# Altium schematic sheet BSheetSchematicTemplateWWU.SchDoc: [SheetTitle]
size B; Date: [Date]; SheetNumber: 1; SheetTotal: 1
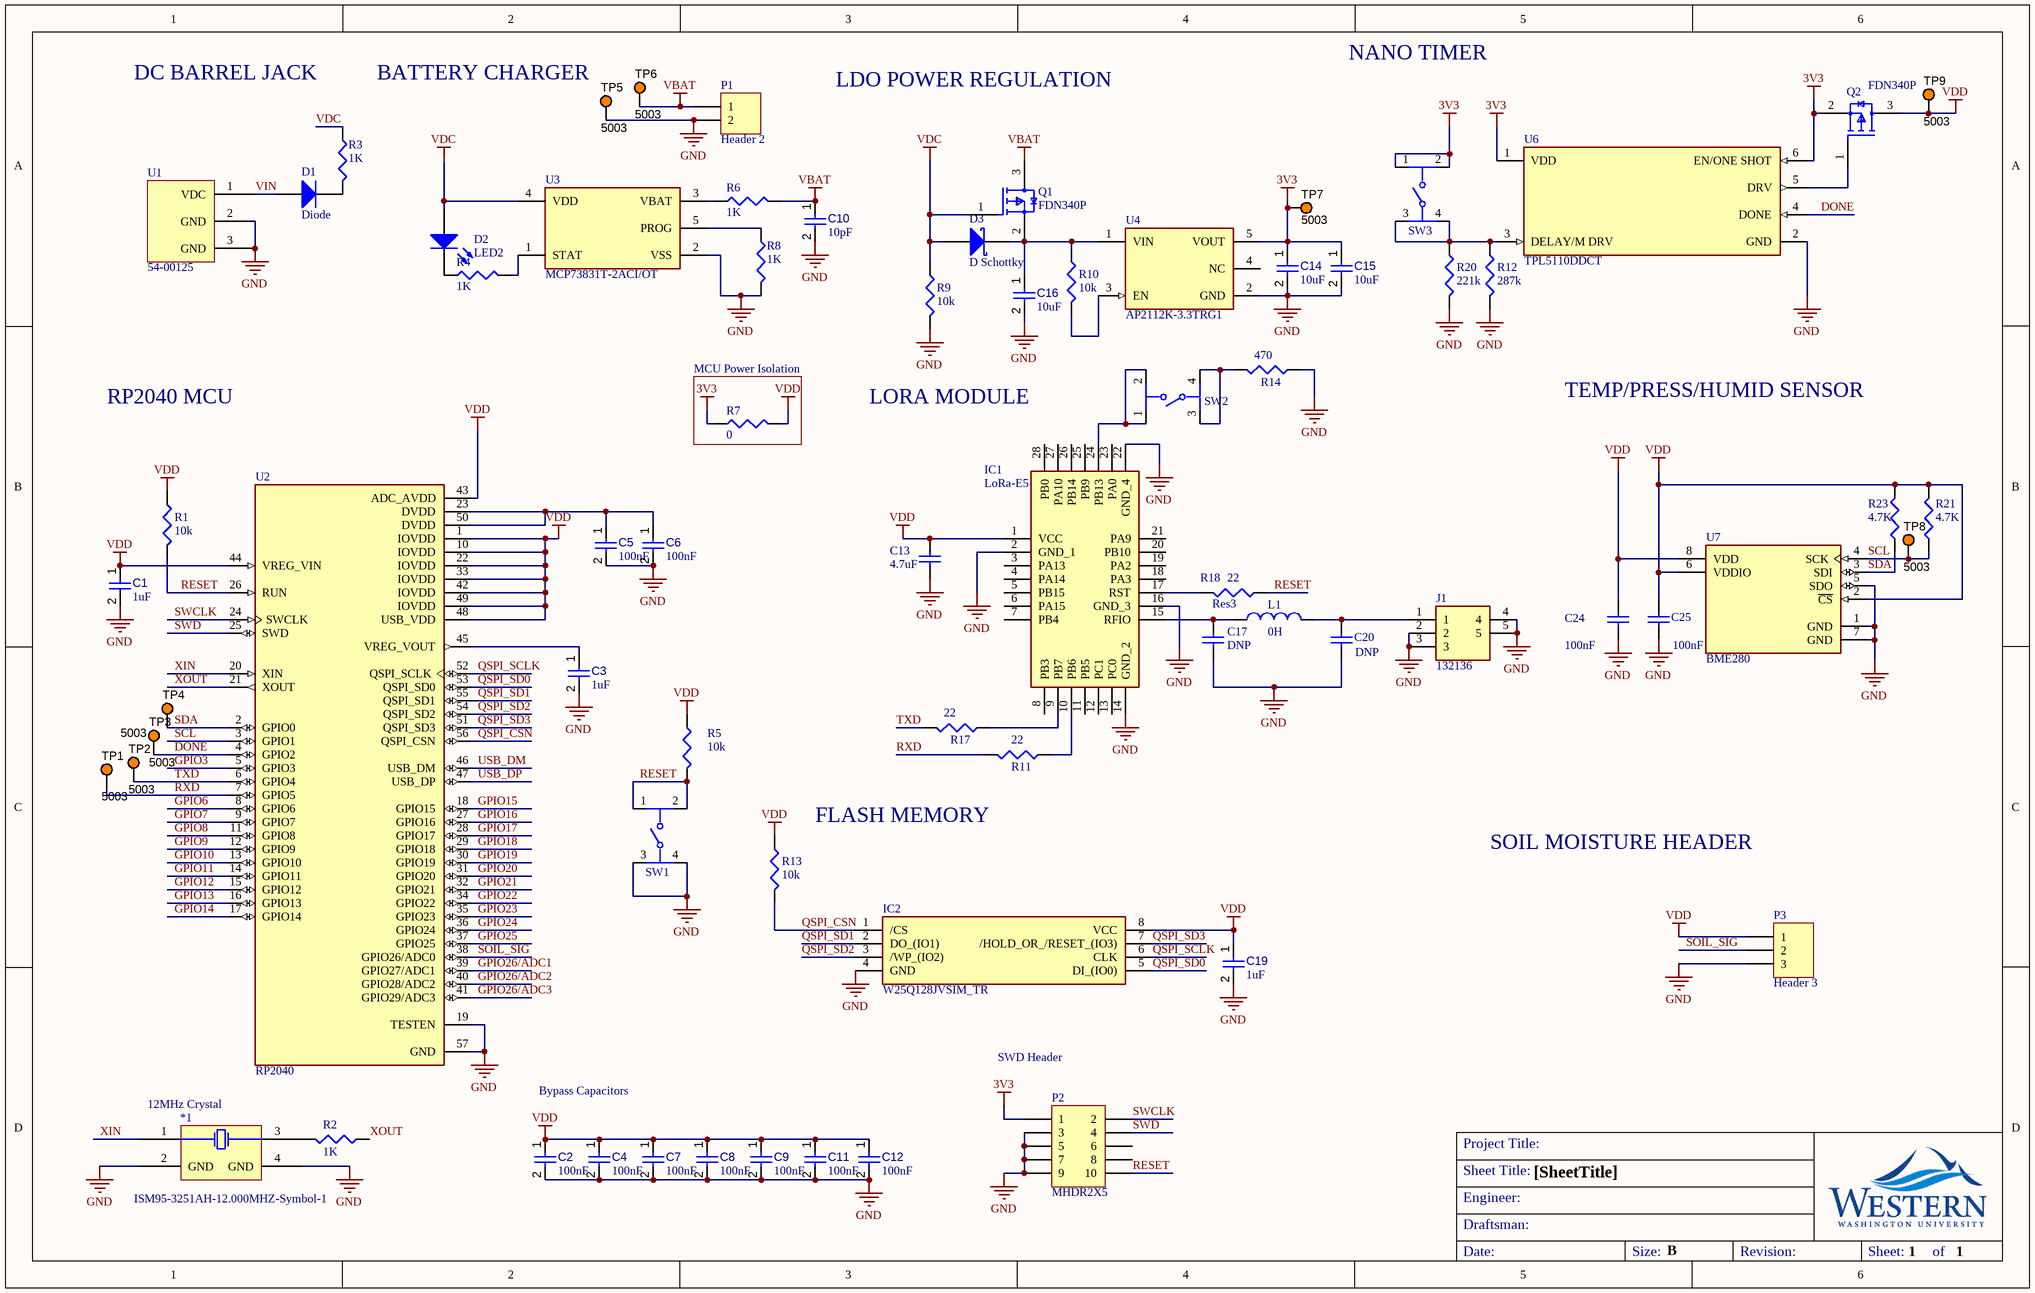
[diagram p0: BSheetSchematicTemplateWWU.SchDoc]

## Parts
*1  ISM95-3251AH-12.000MHZ-Symbol-1  [OSC_ISM951251AH32000MHZ]
C1  value 1uF  [CAPC1608X87X35NL15T15]  (hidden comment: Capacitor 10 pF +/- 0.25 pF 50 V 0603)
C2  value 100nF  [CAPC1608X87X35NL15T15]  (hidden comment: Capacitor 10 pF +/- 0.25 pF 50 V 0603)
C3  value 1uF  [CAPC1608X87X35NL15T15]  (hidden comment: Capacitor 10 pF +/- 0.25 pF 50 V 0603)
C4  value 100nF  [CAPC1608X87X35NL15T15]  (hidden comment: Capacitor 10 pF +/- 0.25 pF 50 V 0603)
C5  value 100nF  [CAPC1608X87X35NL15T15]  (hidden comment: Capacitor 10 pF +/- 0.25 pF 50 V 0603)
C6  value 100nF  [CAPC1608X87X35NL15T15]  (hidden comment: Capacitor 10 pF +/- 0.25 pF 50 V 0603)
C7  value 100nF  [CAPC1608X87X35NL15T15]  (hidden comment: Capacitor 10 pF +/- 0.25 pF 50 V 0603)
C8  value 100nF  [CAPC1608X87X35NL15T15]  (hidden comment: Capacitor 10 pF +/- 0.25 pF 50 V 0603)
C9  value 100nF  [CAPC1608X87X35NL15T15]  (hidden comment: Capacitor 10 pF +/- 0.25 pF 50 V 0603)
C10  value 10pF  [CAPC1608X87X35NL15T15]  (hidden comment: Capacitor 10 pF +/- 0.25 pF 50 V 0603)
C11  value 100nF  [CAPC1608X87X35NL15T15]  (hidden comment: Capacitor 10 pF +/- 0.25 pF 50 V 0603)
C12  value 100nF  [CAPC1608X87X35NL15T15]  (hidden comment: Capacitor 10 pF +/- 0.25 pF 50 V 0603)
C13  value 4.7uF  [1608[0603]]  (hidden comment: Cap Semi)
C14  value 10uF  [CAPC1608X87X35NL15T15]  (hidden comment: Capacitor 10 pF +/- 0.25 pF 50 V 0603)
C15  value 10uF  [CAPC1608X87X35NL15T15]  (hidden comment: Capacitor 10 pF +/- 0.25 pF 50 V 0603)
C16  value 10uF  [CAPC1608X87X35NL15T15]  (hidden comment: Capacitor 10 pF +/- 0.25 pF 50 V 0603)
C17  value DNP  [1608[0603]]  (hidden comment: Cap Semi)
C19  value 1uF  [CAPC1608X87X35NL15T15]  (hidden comment: Capacitor 10 pF +/- 0.25 pF 50 V 0603)
C20  value DNP  [1608[0603]]  (hidden comment: Cap Semi)
C24  value 100nF  [1608[0603]]  (hidden comment: Cap Semi)
C25  value 100nF  [1608[0603]]  (hidden comment: Cap Semi)
D1  Diode  [SMC]
D2  LED2  [3.2X1.6X1.1]
D3  D Schottky  [SMB]
IC1  LoRa-E5  [LoRaE5]
IC2  W25Q128JVSIM_TR  [SOIC127P790X216-8N]
J1  132136  [132136]
L1  value 0H  [0603]  (hidden comment: Inductor)
P1  Header 2  [HDR1X2]
P2  MHDR2X5  [MHDR2X5]
P3  Header 3  [HDR1X3]
Q1  FDN340P  [FP-527AG-MFG]
Q2  FDN340P  [FP-527AG-MFG]
R1  value 10k  [J1-0603]  (hidden comment: Res3)
R2  value 1K  [J1-0603]  (hidden comment: Res3)
R3  value 1K  [J1-0603]  (hidden comment: Res3)
R4  value 1K  [J1-0603]  (hidden comment: Res3)
R5  value 10k  [J1-0603]  (hidden comment: Res3)
R6  value 1K  [J1-0603]  (hidden comment: Res3)
R7  value 0  [J1-0603]  (hidden comment: Res3)
R8  value 1K  [J1-0603]  (hidden comment: Res3)
R9  value 10k  [J1-0603]  (hidden comment: Res3)
R10  value 10k  [J1-0603]  (hidden comment: Res3)
R11  value 22  [J1-0603]  (hidden comment: Res3)
R12  value 287k  [J1-0603]  (hidden comment: Res3)
R13  value 10k  [J1-0603]  (hidden comment: Res3)
R14  value 470  [J1-0603]  (hidden comment: Res3)
R17  value 22  [J1-0603]  (hidden comment: Res3)
R18  Res3  value 22  [J1-0603]
R20  value 221k  [J1-0603]  (hidden comment: Res3)
R21  value 4.7K  [J1-0603]  (hidden comment: Res3)
R23  value 4.7K  [J1-0603]  (hidden comment: Res3)
SW1  PTS645SM43SMTR92LFS  [FP-PTS645SM43SMTR92LFS-MFG]  (value not drawn)
SW2  PTS645SM43SMTR92LFS  [FP-PTS645SM43SMTR92LFS-MFG]  (value not drawn)
SW3  PTS645SM43SMTR92LFS  [FP-PTS645SM43SMTR92LFS-MFG]  (value not drawn)
TP1  5003  [KSTN-5003]
TP2  5003  [KSTN-5003]
TP3  5003  [KSTN-5003]
TP4  5003  [KSTN-5003]
TP5  5003  [KSTN-5003]
TP6  5003  [KSTN-5003]
TP7  5003  [KSTN-5003]
TP8  5003  [KSTN-5003]
TP9  5003  [KSTN-5003]
U1  54-00125  [54-00125]
U2  RP2040  [QFN40P700X700X90-57N-D]
U3  MCP73831T-2ACI/OT  [FP-C04-091-OT-IPC_B]
U4  AP2112K-3.3TRG1  [FP-SOT25-IPC_A]
U6  TPL5110DDCT  [FP-DDC0006A-MFG]
U7  BME280  [FP-BME280-MFG]

## Blocks framed on the sheet
MCU Power Isolation: R7

## Nets
3V3: C14.1 C15.1 P2.1 Q2.2(S) R7.1 SW3.1 SW3.2 TP7.1 U4.5(VOUT) U6.1(VDD) U6.6(EN/ONE_SHOT)
GND: *1.2(GND) *1.4(GND) C1.2 C2.2 C3.2 C4.2 C5.2 C6.2 C7.2 C8.2 C9.2 C10.2 C11.2 C12.2 C13.1 C14.2 C15.2 C16.2 C17.1 C19.2 C20.1 C24.1 C25.1 IC1.2(GND_1) IC1.14(GND_2) IC1.16(GND_3) IC1.22(GND_4) IC2.4(GND) J1.2 J1.3 J1.4 J1.5 P1.2 P2.3 P2.5 P2.7 P2.9 P3.3 R8.2 R9.2 R12.2 R14.1 R20.2 SW1.3 SW1.4 TP5.1 U1.2(GND) U1.3(GND) U2.19(TESTEN) U2.57(GND) U3.2(VSS) U4.2(GND) U6.2(GND) U7.1(GND) U7.5(SDO) U7.7(GND)
VBAT: C10.1 P1.1 Q1.3(D) R6.2 TP6.1
VDC: D2.1(A) D3.1(A) Q1.1(G) R3.1 R9.1 U3.4(VDD)
VDD: C1.1 C2.1 C4.1 C7.1 C8.1 C9.1 C11.1 C12.1 C13.2 C19.1 C24.2 C25.2 IC1.1(VCC) IC2.8(VCC) P3.1 Q2.3(D) R1.1 R5.1 R7.2 R13.1 R21.2 R23.2 TP9.1 U2.1(IOVDD) U2.10(IOVDD) U2.22(IOVDD) U2.33(IOVDD) U2.42(IOVDD) U2.43(ADC_AVDD) U2.44(VREG_VIN) U2.48(USB_VDD) U2.49(IOVDD) U7.2(~{CS}) U7.6(VDDIO) U7.8(VDD)
DONE: TP3.1 U2.4(GPIO2) U6.4(DONE)
GPIO3: U2.5(GPIO3)
GPIO6: U2.8(GPIO6)
GPIO7: U2.9(GPIO7)
GPIO8: U2.11(GPIO8)
GPIO9: U2.12(GPIO9)
GPIO10: U2.13(GPIO10)
GPIO11: U2.14(GPIO11)
GPIO12: U2.15(GPIO12)
GPIO13: U2.16(GPIO13)
GPIO14: U2.17(GPIO14)
GPIO15: U2.18(GPIO15)
GPIO16: U2.27(GPIO16)
GPIO17: U2.28(GPIO17)
GPIO18: U2.29(GPIO18)
GPIO19: U2.30(GPIO19)
GPIO20: U2.31(GPIO20)
GPIO21: U2.32(GPIO21)
GPIO22: U2.34(GPIO22)
GPIO23: U2.35(GPIO23)
GPIO24: U2.36(GPIO24)
GPIO25: U2.37(GPIO25)
GPIO26/ADC1: U2.39(GPIO27/ADC1)
GPIO26/ADC2: U2.40(GPIO28/ADC2)
GPIO26/ADC3: U2.41(GPIO29/ADC3)
QSPI_CSN: IC2.1(/CS) R13.2 U2.56(QSPI_CSN)
QSPI_SCLK: IC2.6(CLK) U2.52(QSPI_SCLK)
QSPI_SD0: IC2.5(DI_(IO0)) U2.53(QSPI_SD0)
QSPI_SD1: IC2.2(DO_(IO1)) U2.55(QSPI_SD1)
QSPI_SD2: IC2.3(/WP_(IO2)) U2.54(QSPI_SD2)
QSPI_SD3: IC2.7(/HOLD_OR_/RESET_(IO3)) U2.51(QSPI_SD3)
RESET: P2.10 R1.2 R5.2 R18.1 SW1.1 SW1.2 U2.26(RUN)
RXD: R11.2 TP1.1 U2.7(GPIO5)
SCL: R21.1 TP8.1 U2.3(GPIO1) U7.4(SCK)
SDA: R23.1 TP4.1 U2.2(GPIO0) U7.3(SDI)
SOIL_SIG: P3.2 U2.38(GPIO26/ADC0)
SWCLK: P2.2 U2.24(SWCLK)
SWD: P2.4 U2.25(SWD)
TXD: R17.2 TP2.1 U2.6(GPIO4)
USB_DM: U2.46(USB_DM)
USB_DP: U2.47(USB_DP)
VIN: D1.1(A) U1.1(VDC)
XIN: *1.1(X1) U2.20(XIN)
XOUT: R2.1 U2.21(XOUT)
Net*1_3: *1.3(X2) R2.2
NetC3_1: C3.1 U2.45(VREG_VOUT)
NetC5_1: C5.1 C6.1 U2.23(DVDD) U2.50(DVDD)
NetC16_1: C16.1 D3.2(K) Q1.2(S) R10.1 U4.1(VIN)
NetC17_2: C17.2 IC1.15(RFIO) L1.1
NetC20_2: C20.2 J1.1 L1.2
NetD1_2: D1.2(K) R3.2
NetD2_2: D2.2(K) R4.1
NetIC1_9: IC1.9(PB7) R17.1
NetIC1_10: IC1.10(PB6) R11.1
NetIC1_17: IC1.17(RST) R18.2
NetIC1_24: IC1.24(PB13) SW2.1 SW2.2
NetQ2_1: Q2.1(G) U6.5(DRV)
NetR4_2: R4.2 U3.1(STAT)
NetR6_1: R6.1 U3.3(VBAT)
NetR8_1: R8.1 U3.5(PROG)
NetR10_2: R10.2 U4.3(EN)
NetR12_1: R12.1 R20.1 SW3.3 SW3.4 U6.3(DELAY/M_DRV)
NetR14_2: R14.2 SW2.3 SW2.4

Not connected (* = marked no-connect by the designer): IC1 3(PA13) 4(PA14) 5(PB15) 6(PA15) 7(PB4) 8(PB3) 11(PB5) 12(PC1) 13(PC0) 18(PA3) 19(PA2) 20(PB10) 21(PA9) 23(PA0) 25(PB9) 26(PB14) 27(PA10) 28(PB0); P2 6 8; U4 4(NC)

## Notes on the sheet
- DC BARREL JACK
- BATTERY CHARGER
- LDO POWER REGULATION
- NANO TIMER
- RP2040 MCU
- LORA MODULE
- TEMP/PRESS/HUMID SENSOR
- FLASH MEMORY
- SOIL MOISTURE HEADER
- (near *1) 12MHz Crystal
- Bypass Capacitors
- SWD Header
- Sheet Title:
- Project Title:
- Engineer:
- Draftsman:
- Date:
- Size:
- B
- Revision:
- Sheet:        of

## Library data of the parts
C1-C12 C14-C16 C19 = CMP-001-00012-5: Chip Capacitor, 10 pF, +/- 0.25 pF, 50 V, 0603 (1608 Metric); Capacitor Type: Ceramic; Voltage Rating: 50V; Tolerance: 0.25%; Min Operating Temperature: -55°C; Case/Package: 0603; Pins: 2; RoHS Compliant: True; Max Operating Temperature: 125°C; Mounting Technology: SM
C13 C17 C20 C24 C25 = Cap Semi: Capacitor (Semiconductor SIM Model); Published: 8-Jun-2000; LatestRevisionDate: 29-May-2009; LatestRevisionNote: IPC-7351 Footprint Added.; PackageReference: C1206; Publisher: Altium Limited; PackageDescription: Chip Capacitor
D1 = Diode: Default Diode; Published: 8-Jun-2000; LatestRevisionDate: 17-Jul-2002; LatestRevisionNote: Re-released for DXP Platform.; PackageVersion: Sep-1996; PackageReference: SMC; Publisher: Altium Limited; PackageDescription: DO-214-AB/SMC; 2 C-Bend Leads; Body 7.9 x 5.9 mm, inc. leads (LxW); Code_JEDEC: DO-214-AB
D2 = LED2: Typical RED, GREEN, YELLOW, AMBER GaAs LED; Published: 8-Jun-2000; LatestRevisionDate: 17-Jul-2002; LatestRevisionNote: Re-released for DXP Platform.; PackageVersion: Feb-2002; PackageReference: 3.2X1.6X1.1; Publisher: Altium Limited; PackageDescription: SM LED; 2 Flat Leads
D3 = D Schottky: Schottky Diode; Published: 8-Jun-2000; LatestRevisionDate: 17-Jul-2002; LatestRevisionNote: Re-released for DXP Platform.; PackageReference: SMB; Publisher: Altium Limited; PackageDescription: DO-214-AA/SMB; 2 C-Bend Leads; Body 5.3 x 3.6 mm, inc. leads (LxW); Code_JEDEC: DO-214-AA
IC1 = LoRa-E5: Integrated Circuit; Manufacturer_Name: Seeed Studio; Datasheet Link: https://no.mouser.com/datasheet/2/744/LoRa_E5_module_datasheet_V1_0-2488126.pdf; Height: 2.5mm; Manufacturer_Part_Number: LoRa-E5
IC2 = W25Q128JVSIM_TR: Integrated Circuit; Manufacturer_Name: Winbond; Manufacturer_Part_Number: W25Q128JVSIM TR; Datasheet Link: http://www.winbond.com/resource-files/w25q128jv%20dtr%20revb%2011042016.pdf; Height: 2.16mm; Mouser Part Number: 454-W25Q128JVSIMTR; Mouser Price/Stock: https://www.mouser.co.uk/ProductDetail/Winbond/W25Q128JVSIM-TR?qs=qSfuJ%252Bfl%2Fd6ji9IuruL6Zg%3D%3D; Arrow Part Number: W25Q128JVSIM TR; Arrow Price/Stock: https://www.arrow.com/en/products/w25q128jvsimtr/winbond-electronics?region=nac
J1 = 132136: Connector; Manufacturer_Name: Amphenol; Datasheet Link: https://componentsearchengine.com/Datasheets/5/132136.pdf; Height: 10.26mm; Manufacturer_Part_Number: 132136; Mouser Part Number: 523-132136; Mouser Price/Stock: https://www.mouser.co.uk/ProductDetail/Amphenol-RF/132136?qs=Ld4zsxSTIA6C8fkM7Uvm2Q%3D%3D; Arrow Part Number: 132136; Arrow Price/Stock: https://www.arrow.com/en/products/132136/amphenol-rf
L1 = Inductor: Code_IEC: 1005; Published: 8-Jun-2000; LatestRevisionDate: 29-May-2009; LatestRevisionNote: IPC-7351 Footprint Added.; PackageReference: 0402-A; Publisher: Altium Limited; PackageDescription: Chip Inductor; Code_JEITA: 0402
P1 = Header 2: Header, 2-Pin; LatestRevisionDate: 17-Jul-2002; LatestRevisionNote: Re-released for DXP Platform.; Publisher: Altium Limited
P2 = MHDR2X5: Header, 5-Pin, Dual row; LatestRevisionDate: 17-Jul-2002; LatestRevisionNote: Re-released for DXP Platform.; Publisher: Altium Limited
P3 = Header 3: Header, 3-Pin; LatestRevisionDate: 17-Jul-2002; LatestRevisionNote: Re-released for DXP Platform.; Publisher: Altium Limited
Q1 Q2 = CMP-2100-03638-2: MOSFET P-CH 20V 2A SSOT3; Fall Time: 11ns; Rise Time: 9ns; Voltage Rating (DC): -20V; Power Dissipation: 500mW; Nominal Vgs: -800mV; Current Rating: -2A; Gate to Source Voltage (Vgs): 8V; Rds On Max: 70mR; Turn-Off Delay Time: 27ns; Element Configuration: Single; Number of Elements: 1; Input Capacitance: 779pF; Drain to Source Resistance: 60mR; Turn-On Delay Time: 10ns; Package Quantity: 1; Mount: Surface Mount; Case/Package: SOT-23; Min Operating Temperature: -55°C; REACH SVHC: No SVHC; Weight: 0.03g; Packaging: Tape and Reel; Threshold Voltage: -800mV; Max Operating Temperature: 150°C; Dual Supply Voltage: -20V; Termination: SMD/SMT; Drain to Source Voltage (Vdss): 20V; Height: 0.94mm; Length: 2.92mm; Contact Plating: Tin; Width: 3.05mm; Drain to Source Breakdown Voltage: -20V; Max Power Dissipation: 500mW; Continuous Drain Current (ID): 2A; Number of Pins: 3; Lead Free: Lead Free; Radiation Hardening: No; On-State Resistance: 70MR
R1-R14 R17 R18 R20 R21 R23 = Res3: Resistor; Published: 8-Jun-2000; LatestRevisionDate: 29-May-2009; LatestRevisionNote: IPC-7351 Footprint Added.; PackageReference: J1-0603; Publisher: Altium Limited; PackageDescription: Chip Resistor
SW1-SW3 = CMP-2000-05160-2: SWITCH TACTILE SPST-NO 0.05A 12V; Contact Resistance: 100mR; Throw Configuration: SPST; Illumination Type: Non-Illuminated; Mechanical Life: 100000Cycles; Current Rating: 50mA; Switch Function: Off-Mom; Actuator Length: 0.85mm; Actuator Material: Nylon; Actuator Type: Standard; Operating Force: 160gf; Min Operating Temperature: -20°C; REACH SVHC: No SVHC; Termination: Gull Wing; Case/Package: SMD/SMT; Packaging: Tape and Reel; Mount: Surface Mount; Voltage Rating (DC): 12V; Orientation: Straight; Lead Free: Lead Free; Contact Material: Silver; Color: Black; Max Current Rating: 50mA; Contact Plating: Silver; Depth: 9mm; Package Quantity: 1; Max Voltage Rating (DC): 12V; Length: 6mm; Max Operating Temperature: 60°C
TP1-TP9 = CMP-002-00037-1: Test Point, Orange, Height 4.6 mm, Tail Length 3 mm, 1-Pin THD, RoHS; Manufacturer: Keystone; Package Description: 1-Pin Through Hole Device, Dia 2.54 mm; Package Quantity: 10; Case/Package: 5003; RoHS Compliant: True; Packaging: Bulk; Pins: 1; Diameter: 2.54mm; Connector Type: TestPoint; Manufacturer URL: http://www.keyelco.com/; Colour: Orange; Package Reference: 5003; Datasheet Version: Jun-15; Contact Material: Bronze; Mounting Technology: TH; Contact Plating: Tin; Datasheet URL: http://keyelco.com/userAssets/file/M65p56.pdf
U1 = 54-00125: 3.5x1.1mm Barrel Jack Connector
U2 = RP2040: RP2040 Raspberry Pi Pico - ARMÂ® CortexÂ®-M0+ MCU 32-Bit Embedded Evaluation Board; Price: None; SnapEDA_Link: https://www.snapeda.com/parts/RP2040/Raspberry%20Pi/view-part/5800506/?ref=snap; Purchase-URL: https://pricing.snapeda.com/search/part/RP2040/?ref=eda; Check_prices: https://www.snapeda.com/parts/RP2040/Raspberry%20Pi/view-part/5800506/?ref=eda; MF: Raspberry Pi; Value: *; MP: RP2040; Package: Package; Availability: In Stock
U3 = CMP-0133-00143-2: IC CONTROLLR LI-ION 4.2V SOT23-5; Max Power Dissipation: 1.54W; Output Current: 500mA; Max Output Voltage: 4.5V; Number of Outputs: 1; Min Output Voltage: 4.168V; Min Supply Voltage: 3.75V; Max Input Voltage: 6V; Voltage Rating: 4.534V; Drain to Source Resistance: 350mR; Max Operating Temperature: 85°C; Length: 0.122inch; Number of Pins: 5; REACH SVHC: No SVHC; Radiation Hardening: No; Min Operating Temperature: -40°C; Weight: 0.00709oz; Contact Plating: Tin; Termination: SMD/SMT; Case/Package: SOT-23; Mount: Surface Mount; Width: 0.071inch; Packaging: Tape and Reel; Number of Cells: 1; Max Charge Current: 500mA; Height: 0.051inch; Number of Channels: 1; Output Voltage: 4.2V; Max Supply Voltage: 6V; Lead Free: Lead Free
U4 = CMP-12756-000035-1: IC REG LINEAR 3.3V 600MA SOT25; Number of Regulators: 1; Output Type: Fixed; Polarity: Positive; Min Input Voltage: 2.5V; Max Input Voltage: 6V; Accuracy: 1.5%; Quiescent Current: 55uA; Dropout Voltage: 250mV; Min Operating Temperature: -40°C; Length: 3.1mm; Output Current: 600mA; Max Operating Temperature: 85°C; Package Quantity: 1; Output Voltage: 3.3V; Width: 1.7mm; Number of Outputs: 1; Packaging: Tape and Reel; Height: 1.3mm; Lead Free: Lead Free; Max Output Current: 600mA; Case/Package: SOT-23-5; Mount: Surface Mount; Number of Pins: 5
U6 = CMP-04858-000011-1: IC OSC PROG TIMER TSOT23-6; Manufacturer: Texas Instruments; Number Of Timers/Counters: 1; Max Supply Voltage: 5.5V; Max Junction Temp: +150°C; Standoff Height: 0mm; Nominal Supply Current: 0.035uA; Min Supply Voltage: 1.8V; Mouser Description: Timers & Support Products Ultra Lw Pwr Timer; Device Class L1: Integrated Circuits (ICs); ComponentLink2Description: Datasheet; Temperature Range Low: -40°C; Height: 1.1mm; Package: DDC0006A; Manufacturer Part Number: TPL5110DDCT; Device Class L2: Clock and Timing; Automotive: No; Octopart: https://octopart.com/tpl5110ddct-texas+instruments-52670271; Lead Free: Yes; RoHS: TRUE; Category: IC; Digikey Description: IC OSC PROG TIMER TSOT23-6; Device Class L3: Timers and Oscillators; Temperature Range High: +105°C; Temperature: -40°C to +105°C; ComponentLink2URL: http://www.ti.com/lit/ds/symlink/tpl5110.pdf
U7 = CMP-2000-05073-3: SENSOR PRESSURE HUMIDITY TEMP; Sensor Type: Temperature; Accuracy: 3%; Response Time: 1s; Output Type: SPI; Min Operating Temperature: -40°C; Max Operating Temperature: 85°C; Case/Package: LGA; Packaging: Cut Tape; Mount: Surface Mount; Lead Free: Lead Free; Number of Pins: 8